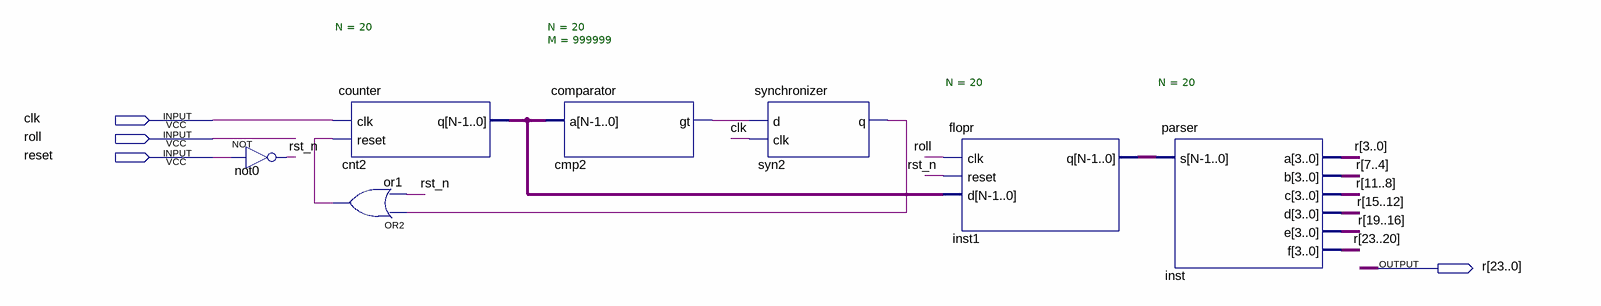
[diagram p0: schematic sheet]
// Quartus schematic randomizer.bdf as structural Verilog: 7 symbols, 4 pins
module randomizer (
  input  clk,
  input  roll,
  input  reset,
  output [23:0] r
);

  wire cmp2_gt, or1_out, rst_n, syn2_q;
  wire [19:0] cnt2_q, inst1_q;

  not not0 (rst_n, reset);
  counter #(.N(20)) cnt2 (.clk(clk), .reset(or1_out), .q(cnt2_q));
  or or1 (or1_out, syn2_q, rst_n);
  comparator #(.N(20), .M(999999)) cmp2 (.a(cnt2_q), .gt(cmp2_gt));
  synchronizer syn2 (.d(cmp2_gt), .clk(clk), .q(syn2_q));
  flopr #(.N(20)) inst1 (.clk(roll), .reset(rst_n), .d(cnt2_q), .q(inst1_q));
  parser #(.N(20)) inst (.s(inst1_q), .a(r[3:0]), .b(r[7:4]), .c(r[11:8]), .d(r[15:12]), .e(r[19:16]), .f(r[23:20]));
endmodule
